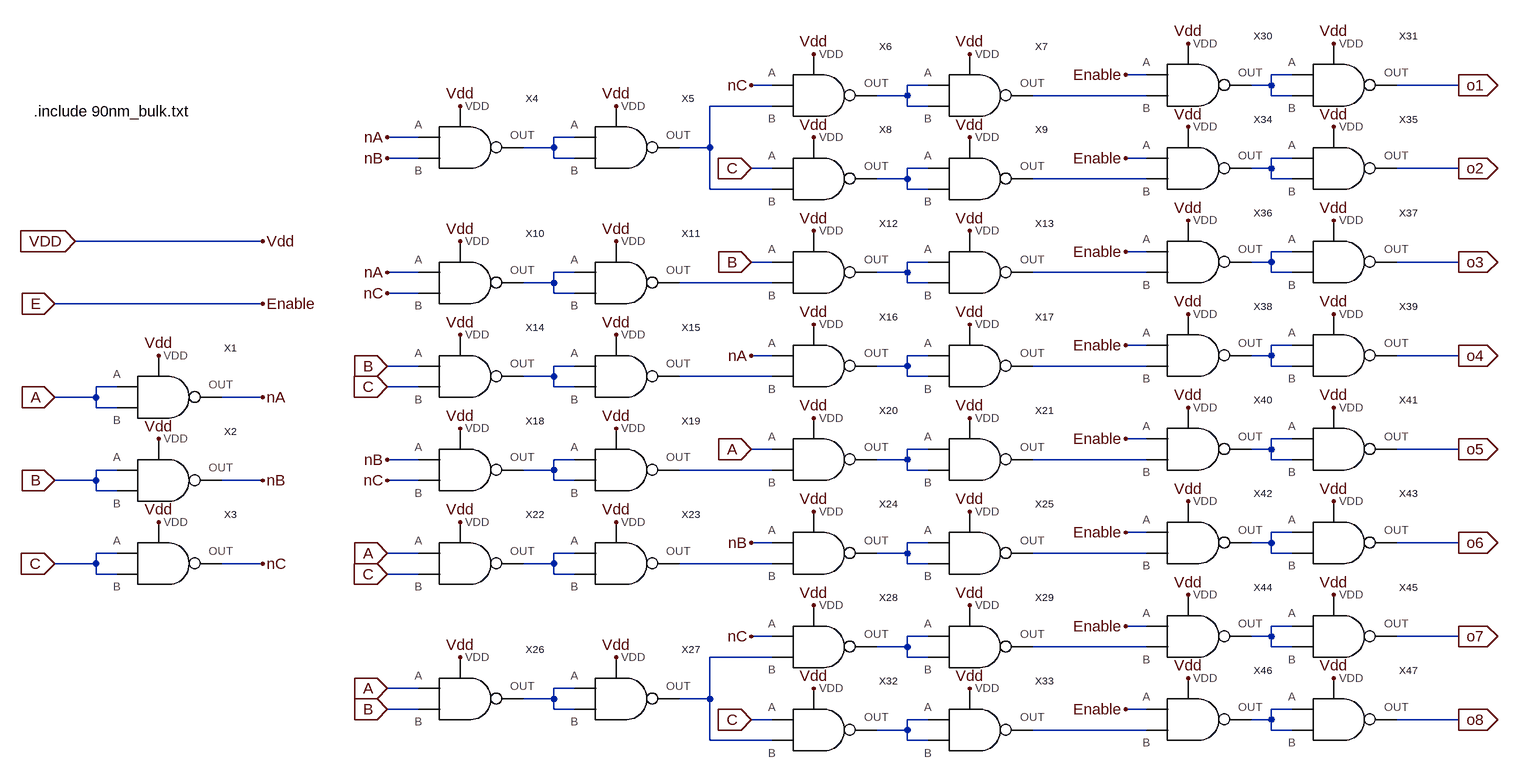
[diagram p0: schematic positional-decoder-3-to-8.asc]
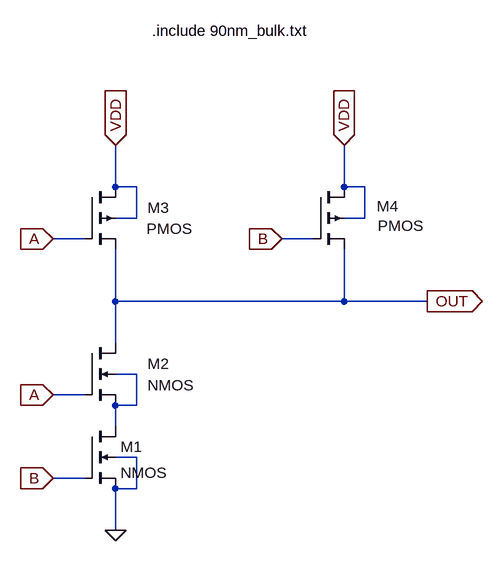
[diagram p1: sub-circuit my-nand.asc]
positional-decoder-3-to-8.asc, the LTspice schematic file:
Version 4
SHEET 1 2312 1224
WIRE 1744 128 1712 128
WIRE 1968 128 1936 128
WIRE 1168 144 1136 144
WIRE 1408 144 1376 144
WIRE 1936 144 1936 128
WIRE 1936 144 1904 144
WIRE 2224 144 2128 144
WIRE 1376 160 1376 144
WIRE 1376 160 1328 160
WIRE 1744 160 1568 160
WIRE 1936 160 1936 144
WIRE 1968 160 1936 160
WIRE 1168 176 1072 176
WIRE 1376 176 1376 160
WIRE 1408 176 1376 176
WIRE 624 224 576 224
WIRE 864 224 832 224
WIRE 832 240 832 224
WIRE 832 240 784 240
WIRE 1072 240 1072 176
WIRE 1072 240 1024 240
WIRE 624 256 576 256
WIRE 832 256 832 240
WIRE 864 256 832 256
WIRE 1744 256 1712 256
WIRE 1968 256 1936 256
WIRE 1168 272 1136 272
WIRE 1408 272 1376 272
WIRE 1936 272 1936 256
WIRE 1936 272 1904 272
WIRE 2224 272 2128 272
WIRE 1376 288 1376 272
WIRE 1376 288 1328 288
WIRE 1744 288 1568 288
WIRE 1936 288 1936 272
WIRE 1968 288 1936 288
WIRE 1072 304 1072 240
WIRE 1168 304 1072 304
WIRE 1376 304 1376 288
WIRE 1408 304 1376 304
WIRE 384 384 96 384
WIRE 1744 400 1712 400
WIRE 1968 400 1936 400
WIRE 1168 416 1136 416
WIRE 1408 416 1376 416
WIRE 1936 416 1936 400
WIRE 1936 416 1904 416
WIRE 2224 416 2128 416
WIRE 624 432 576 432
WIRE 864 432 832 432
WIRE 1376 432 1376 416
WIRE 1376 432 1328 432
WIRE 1744 432 1568 432
WIRE 1936 432 1936 416
WIRE 1968 432 1936 432
WIRE 832 448 832 432
WIRE 832 448 784 448
WIRE 1168 448 1024 448
WIRE 1376 448 1376 432
WIRE 1408 448 1376 448
WIRE 624 464 576 464
WIRE 832 464 832 448
WIRE 864 464 832 464
WIRE 384 480 64 480
WIRE 1744 544 1712 544
WIRE 1968 544 1936 544
WIRE 1168 560 1136 560
WIRE 1408 560 1376 560
WIRE 1936 560 1936 544
WIRE 1936 560 1904 560
WIRE 2224 560 2128 560
WIRE 624 576 576 576
WIRE 864 576 832 576
WIRE 1376 576 1376 560
WIRE 1376 576 1328 576
WIRE 1744 576 1568 576
WIRE 1936 576 1936 560
WIRE 1968 576 1936 576
WIRE 832 592 832 576
WIRE 832 592 784 592
WIRE 1168 592 1024 592
WIRE 1376 592 1376 576
WIRE 1408 592 1376 592
WIRE 160 608 128 608
WIRE 624 608 576 608
WIRE 832 608 832 592
WIRE 864 608 832 608
WIRE 128 624 128 608
WIRE 128 624 64 624
WIRE 384 624 320 624
WIRE 128 640 128 624
WIRE 160 640 128 640
WIRE 1744 688 1712 688
WIRE 1968 688 1936 688
WIRE 1168 704 1136 704
WIRE 1408 704 1376 704
WIRE 1936 704 1936 688
WIRE 1936 704 1904 704
WIRE 2224 704 2128 704
WIRE 624 720 576 720
WIRE 864 720 832 720
WIRE 1376 720 1376 704
WIRE 1376 720 1328 720
WIRE 1744 720 1568 720
WIRE 1936 720 1936 704
WIRE 1968 720 1936 720
WIRE 160 736 128 736
WIRE 832 736 832 720
WIRE 832 736 784 736
WIRE 1168 736 1024 736
WIRE 1376 736 1376 720
WIRE 1408 736 1376 736
WIRE 128 752 128 736
WIRE 128 752 64 752
WIRE 384 752 320 752
WIRE 624 752 576 752
WIRE 832 752 832 736
WIRE 864 752 832 752
WIRE 128 768 128 752
WIRE 160 768 128 768
WIRE 1744 832 1712 832
WIRE 1968 832 1936 832
WIRE 1168 848 1136 848
WIRE 1408 848 1376 848
WIRE 1936 848 1936 832
WIRE 1936 848 1904 848
WIRE 2224 848 2128 848
WIRE 160 864 128 864
WIRE 624 864 576 864
WIRE 864 864 832 864
WIRE 1376 864 1376 848
WIRE 1376 864 1328 864
WIRE 1744 864 1568 864
WIRE 1936 864 1936 848
WIRE 1968 864 1936 864
WIRE 128 880 128 864
WIRE 128 880 64 880
WIRE 384 880 320 880
WIRE 832 880 832 864
WIRE 832 880 784 880
WIRE 1168 880 1024 880
WIRE 1376 880 1376 864
WIRE 1408 880 1376 880
WIRE 128 896 128 880
WIRE 160 896 128 896
WIRE 624 896 576 896
WIRE 832 896 832 880
WIRE 864 896 832 896
WIRE 1744 976 1712 976
WIRE 1968 976 1936 976
WIRE 1168 992 1136 992
WIRE 1408 992 1376 992
WIRE 1936 992 1936 976
WIRE 1936 992 1904 992
WIRE 2224 992 2128 992
WIRE 1376 1008 1376 992
WIRE 1376 1008 1328 1008
WIRE 1744 1008 1568 1008
WIRE 1936 1008 1936 992
WIRE 1968 1008 1936 1008
WIRE 1168 1024 1072 1024
WIRE 1376 1024 1376 1008
WIRE 1408 1024 1376 1024
WIRE 624 1072 576 1072
WIRE 864 1072 832 1072
WIRE 832 1088 832 1072
WIRE 832 1088 784 1088
WIRE 1072 1088 1072 1024
WIRE 1072 1088 1024 1088
WIRE 624 1104 576 1104
WIRE 832 1104 832 1088
WIRE 864 1104 832 1104
WIRE 1744 1104 1712 1104
WIRE 1968 1104 1936 1104
WIRE 1168 1120 1136 1120
WIRE 1408 1120 1376 1120
WIRE 1936 1120 1936 1104
WIRE 1936 1120 1904 1120
WIRE 2224 1120 2128 1120
WIRE 1376 1136 1376 1120
WIRE 1376 1136 1328 1136
WIRE 1744 1136 1568 1136
WIRE 1936 1136 1936 1120
WIRE 1968 1136 1936 1136
WIRE 1072 1152 1072 1088
WIRE 1168 1152 1072 1152
WIRE 1376 1152 1376 1136
WIRE 1408 1152 1376 1152
FLAG 384 624 nA
FLAG 384 752 nB
FLAG 384 880 nC
FLAG 64 624 A
IOPIN 64 624 In
FLAG 64 752 B
IOPIN 64 752 In
FLAG 64 880 C
IOPIN 64 880 In
FLAG 576 224 nA
FLAG 576 256 nB
FLAG 1136 144 nC
FLAG 1136 272 C
IOPIN 1136 272 In
FLAG 2224 144 o1
IOPIN 2224 144 Out
FLAG 576 432 nA
FLAG 576 464 nC
FLAG 1136 416 B
IOPIN 1136 416 In
FLAG 576 608 C
IOPIN 576 608 In
FLAG 576 576 B
IOPIN 576 576 In
FLAG 1136 560 nA
FLAG 576 720 nB
FLAG 576 752 nC
FLAG 1136 704 A
IOPIN 1136 704 In
FLAG 576 864 A
IOPIN 576 864 In
FLAG 576 896 C
IOPIN 576 896 In
FLAG 1136 848 nB
FLAG 576 1072 A
IOPIN 576 1072 In
FLAG 576 1104 B
IOPIN 576 1104 In
FLAG 1136 992 nC
FLAG 1136 1120 C
IOPIN 1136 1120 In
FLAG 224 560 Vdd
FLAG 224 688 Vdd
FLAG 224 816 Vdd
FLAG 688 176 Vdd
FLAG 688 384 Vdd
FLAG 688 528 Vdd
FLAG 688 672 Vdd
FLAG 688 816 Vdd
FLAG 688 1024 Vdd
FLAG 928 1024 Vdd
FLAG 928 816 Vdd
FLAG 928 672 Vdd
FLAG 928 528 Vdd
FLAG 928 384 Vdd
FLAG 928 176 Vdd
FLAG 1232 96 Vdd
FLAG 1232 224 Vdd
FLAG 1472 96 Vdd
FLAG 1472 224 Vdd
FLAG 1472 368 Vdd
FLAG 1232 368 Vdd
FLAG 1232 512 Vdd
FLAG 1232 656 Vdd
FLAG 1472 512 Vdd
FLAG 1472 656 Vdd
FLAG 1232 800 Vdd
FLAG 1472 800 Vdd
FLAG 1232 944 Vdd
FLAG 1472 944 Vdd
FLAG 1232 1072 Vdd
FLAG 1472 1072 Vdd
FLAG 384 480 Enable
FLAG 64 480 E
IOPIN 64 480 In
FLAG 96 384 VDD
IOPIN 96 384 In
FLAG 384 384 Vdd
FLAG 1712 128 Enable
FLAG 1808 80 Vdd
FLAG 2032 80 Vdd
FLAG 2224 272 o2
IOPIN 2224 272 Out
FLAG 1712 256 Enable
FLAG 1808 208 Vdd
FLAG 2032 208 Vdd
FLAG 2224 416 o3
IOPIN 2224 416 Out
FLAG 1712 400 Enable
FLAG 1808 352 Vdd
FLAG 2032 352 Vdd
FLAG 2224 560 o4
IOPIN 2224 560 Out
FLAG 1712 544 Enable
FLAG 1808 496 Vdd
FLAG 2032 496 Vdd
FLAG 2224 704 o5
IOPIN 2224 704 Out
FLAG 1712 688 Enable
FLAG 1808 640 Vdd
FLAG 2032 640 Vdd
FLAG 2224 848 o6
IOPIN 2224 848 Out
FLAG 1712 832 Enable
FLAG 1808 784 Vdd
FLAG 2032 784 Vdd
FLAG 2224 992 o7
IOPIN 2224 992 Out
FLAG 1712 976 Enable
FLAG 1808 928 Vdd
FLAG 2032 928 Vdd
FLAG 2224 1120 o8
IOPIN 2224 1120 Out
FLAG 1712 1104 Enable
FLAG 1808 1056 Vdd
FLAG 2032 1056 Vdd
SYMBOL my-nand 224 624 R0
SYMATTR InstName X1
SYMBOL my-nand 224 752 R0
SYMATTR InstName X2
SYMBOL my-nand 224 880 R0
SYMATTR InstName X3
SYMBOL my-nand 688 240 R0
SYMATTR InstName X4
SYMBOL my-nand 928 240 R0
SYMATTR InstName X5
SYMBOL my-nand 1232 160 R0
SYMATTR InstName X6
SYMBOL my-nand 1472 160 R0
SYMATTR InstName X7
SYMBOL my-nand 1232 288 R0
SYMATTR InstName X8
SYMBOL my-nand 1472 288 R0
SYMATTR InstName X9
SYMBOL my-nand 688 448 R0
SYMATTR InstName X10
SYMBOL my-nand 928 448 R0
SYMATTR InstName X11
SYMBOL my-nand 1232 432 R0
SYMATTR InstName X12
SYMBOL my-nand 1472 432 R0
SYMATTR InstName X13
SYMBOL my-nand 688 592 R0
SYMATTR InstName X14
SYMBOL my-nand 928 592 R0
SYMATTR InstName X15
SYMBOL my-nand 1232 576 R0
SYMATTR InstName X16
SYMBOL my-nand 1472 576 R0
SYMATTR InstName X17
SYMBOL my-nand 688 736 R0
SYMATTR InstName X18
SYMBOL my-nand 928 736 R0
SYMATTR InstName X19
SYMBOL my-nand 1232 720 R0
SYMATTR InstName X20
SYMBOL my-nand 1472 720 R0
SYMATTR InstName X21
SYMBOL my-nand 688 880 R0
SYMATTR InstName X22
SYMBOL my-nand 928 880 R0
SYMATTR InstName X23
SYMBOL my-nand 1232 864 R0
SYMATTR InstName X24
SYMBOL my-nand 1472 864 R0
SYMATTR InstName X25
SYMBOL my-nand 688 1088 R0
SYMATTR InstName X26
SYMBOL my-nand 928 1088 R0
SYMATTR InstName X27
SYMBOL my-nand 1232 1008 R0
SYMATTR InstName X28
SYMBOL my-nand 1472 1008 R0
SYMATTR InstName X29
SYMBOL my-nand 1232 1136 R0
SYMATTR InstName X32
SYMBOL my-nand 1472 1136 R0
SYMATTR InstName X33
SYMBOL my-nand 1808 144 R0
SYMATTR InstName X30
SYMBOL my-nand 2032 144 R0
SYMATTR InstName X31
SYMBOL my-nand 1808 272 R0
SYMATTR InstName X34
SYMBOL my-nand 2032 272 R0
SYMATTR InstName X35
SYMBOL my-nand 1808 416 R0
SYMATTR InstName X36
SYMBOL my-nand 2032 416 R0
SYMATTR InstName X37
SYMBOL my-nand 1808 560 R0
SYMATTR InstName X38
SYMBOL my-nand 2032 560 R0
SYMATTR InstName X39
SYMBOL my-nand 1808 704 R0
SYMATTR InstName X40
SYMBOL my-nand 2032 704 R0
SYMATTR InstName X41
SYMBOL my-nand 1808 848 R0
SYMATTR InstName X42
SYMBOL my-nand 2032 848 R0
SYMATTR InstName X43
SYMBOL my-nand 1808 992 R0
SYMATTR InstName X44
SYMBOL my-nand 2032 992 R0
SYMATTR InstName X45
SYMBOL my-nand 1808 1120 R0
SYMATTR InstName X46
SYMBOL my-nand 2032 1120 R0
SYMATTR InstName X47
TEXT 32 184 Left 2 !.include 90nm_bulk.txt

my-nand.asc, the sub-circuit schematic file:
Version 4
SHEET 1 924 680
WIRE 224 16 224 -48
WIRE 256 16 224 16
WIRE 576 16 576 -48
WIRE 608 16 576 16
WIRE 256 64 256 16
WIRE 256 64 224 64
WIRE 608 64 608 16
WIRE 608 64 576 64
WIRE 176 96 128 96
WIRE 528 96 480 96
WIRE 224 192 224 112
WIRE 576 192 576 112
WIRE 576 192 224 192
WIRE 704 192 576 192
WIRE 224 256 224 192
WIRE 256 304 224 304
WIRE 176 336 128 336
WIRE 256 352 256 304
WIRE 256 352 224 352
WIRE 224 384 224 352
WIRE 256 432 224 432
WIRE 176 464 128 464
WIRE 256 480 256 432
WIRE 256 480 224 480
WIRE 224 544 224 480
FLAG 576 -48 VDD
IOPIN 576 -48 In
FLAG 224 -48 VDD
IOPIN 224 -48 In
FLAG 704 192 OUT
IOPIN 704 192 Out
FLAG 128 96 A
IOPIN 128 96 In
FLAG 128 336 A
IOPIN 128 336 In
FLAG 480 96 B
IOPIN 480 96 In
FLAG 128 464 B
IOPIN 128 464 In
FLAG 224 544 0
SYMBOL nmos4 176 384 R0
SYMATTR InstName M1
SYMATTR Value2 l=90n w=200n
SYMBOL nmos4 176 256 R0
WINDOW 0 97 32 Left 2
WINDOW 3 97 65 Left 2
SYMATTR InstName M2
SYMATTR Value2 l=90n w=200n
SYMBOL pmos4 176 16 R0
WINDOW 0 97 32 Left 2
WINDOW 3 96 64 Left 2
SYMATTR InstName M3
SYMATTR Value2 l=90n w=400n
SYMBOL pmos4 528 16 R0
WINDOW 0 98 30 Left 2
WINDOW 3 100 60 Left 2
SYMATTR InstName M4
SYMATTR Value2 l=90n w=400n
TEXT 280 -224 Left 2 !.include 90nm_bulk.txt

The netlist it stands for:
* positional-decoder-3-to-8.asc
XX1 nA A A Vdd my-nand
XX2 nB B B Vdd my-nand
XX3 nC C C Vdd my-nand
XX4 N005 nA nB Vdd my-nand
XX5 N004 N005 N005 Vdd my-nand
XX6 N002 nC N004 Vdd my-nand
XX7 N003 N002 N002 Vdd my-nand
XX8 N007 C N004 Vdd my-nand
XX9 N008 N007 N007 Vdd my-nand
XX10 N011 nA nC Vdd my-nand
XX11 N013 N011 N011 Vdd my-nand
XX12 N010 B N013 Vdd my-nand
XX13 N012 N010 N010 Vdd my-nand
XX14 N016 B C Vdd my-nand
XX15 N018 N016 N016 Vdd my-nand
XX16 N015 nA N018 Vdd my-nand
XX17 N017 N015 N015 Vdd my-nand
XX18 N021 nB nC Vdd my-nand
XX19 N023 N021 N021 Vdd my-nand
XX20 N020 A N023 Vdd my-nand
XX21 N022 N020 N020 Vdd my-nand
XX22 N026 A C Vdd my-nand
XX23 N028 N026 N026 Vdd my-nand
XX24 N025 nB N028 Vdd my-nand
XX25 N027 N025 N025 Vdd my-nand
XX26 N033 A B Vdd my-nand
XX27 N032 N033 N033 Vdd my-nand
XX28 N030 nC N032 Vdd my-nand
XX29 N031 N030 N030 Vdd my-nand
XX32 N035 C N032 Vdd my-nand
XX33 N036 N035 N035 Vdd my-nand
XX30 N001 E N003 Vdd my-nand
XX31 o1 N001 N001 Vdd my-nand
XX34 N006 E N008 Vdd my-nand
XX35 o2 N006 N006 Vdd my-nand
XX36 N009 E N012 Vdd my-nand
XX37 o3 N009 N009 Vdd my-nand
XX38 N014 E N017 Vdd my-nand
XX39 o4 N014 N014 Vdd my-nand
XX40 N019 E N022 Vdd my-nand
XX41 o5 N019 N019 Vdd my-nand
XX42 N024 E N027 Vdd my-nand
XX43 o6 N024 N024 Vdd my-nand
XX44 N029 E N031 Vdd my-nand
XX45 o7 N029 N029 Vdd my-nand
XX46 N034 E N036 Vdd my-nand
XX47 o8 N034 N034 Vdd my-nand

* block symbol definitions
.subckt my-nand OUT A B VDD
M1 N001 B 0 0 NMOS l=90n w=200n
M2 OUT A N001 N001 NMOS l=90n w=200n
M3 VDD A OUT VDD PMOS l=90n w=400n
M4 VDD B OUT VDD PMOS l=90n w=400n
.include 90nm_bulk.txt
.ends my-nand

.model NMOS NMOS
.model PMOS PMOS
.lib standard.mos
.include 90nm_bulk.txt
.backanno
.end